# Altium project ASV4-1 Actuation Driver Board.PrjPcb (part 1 of 3)
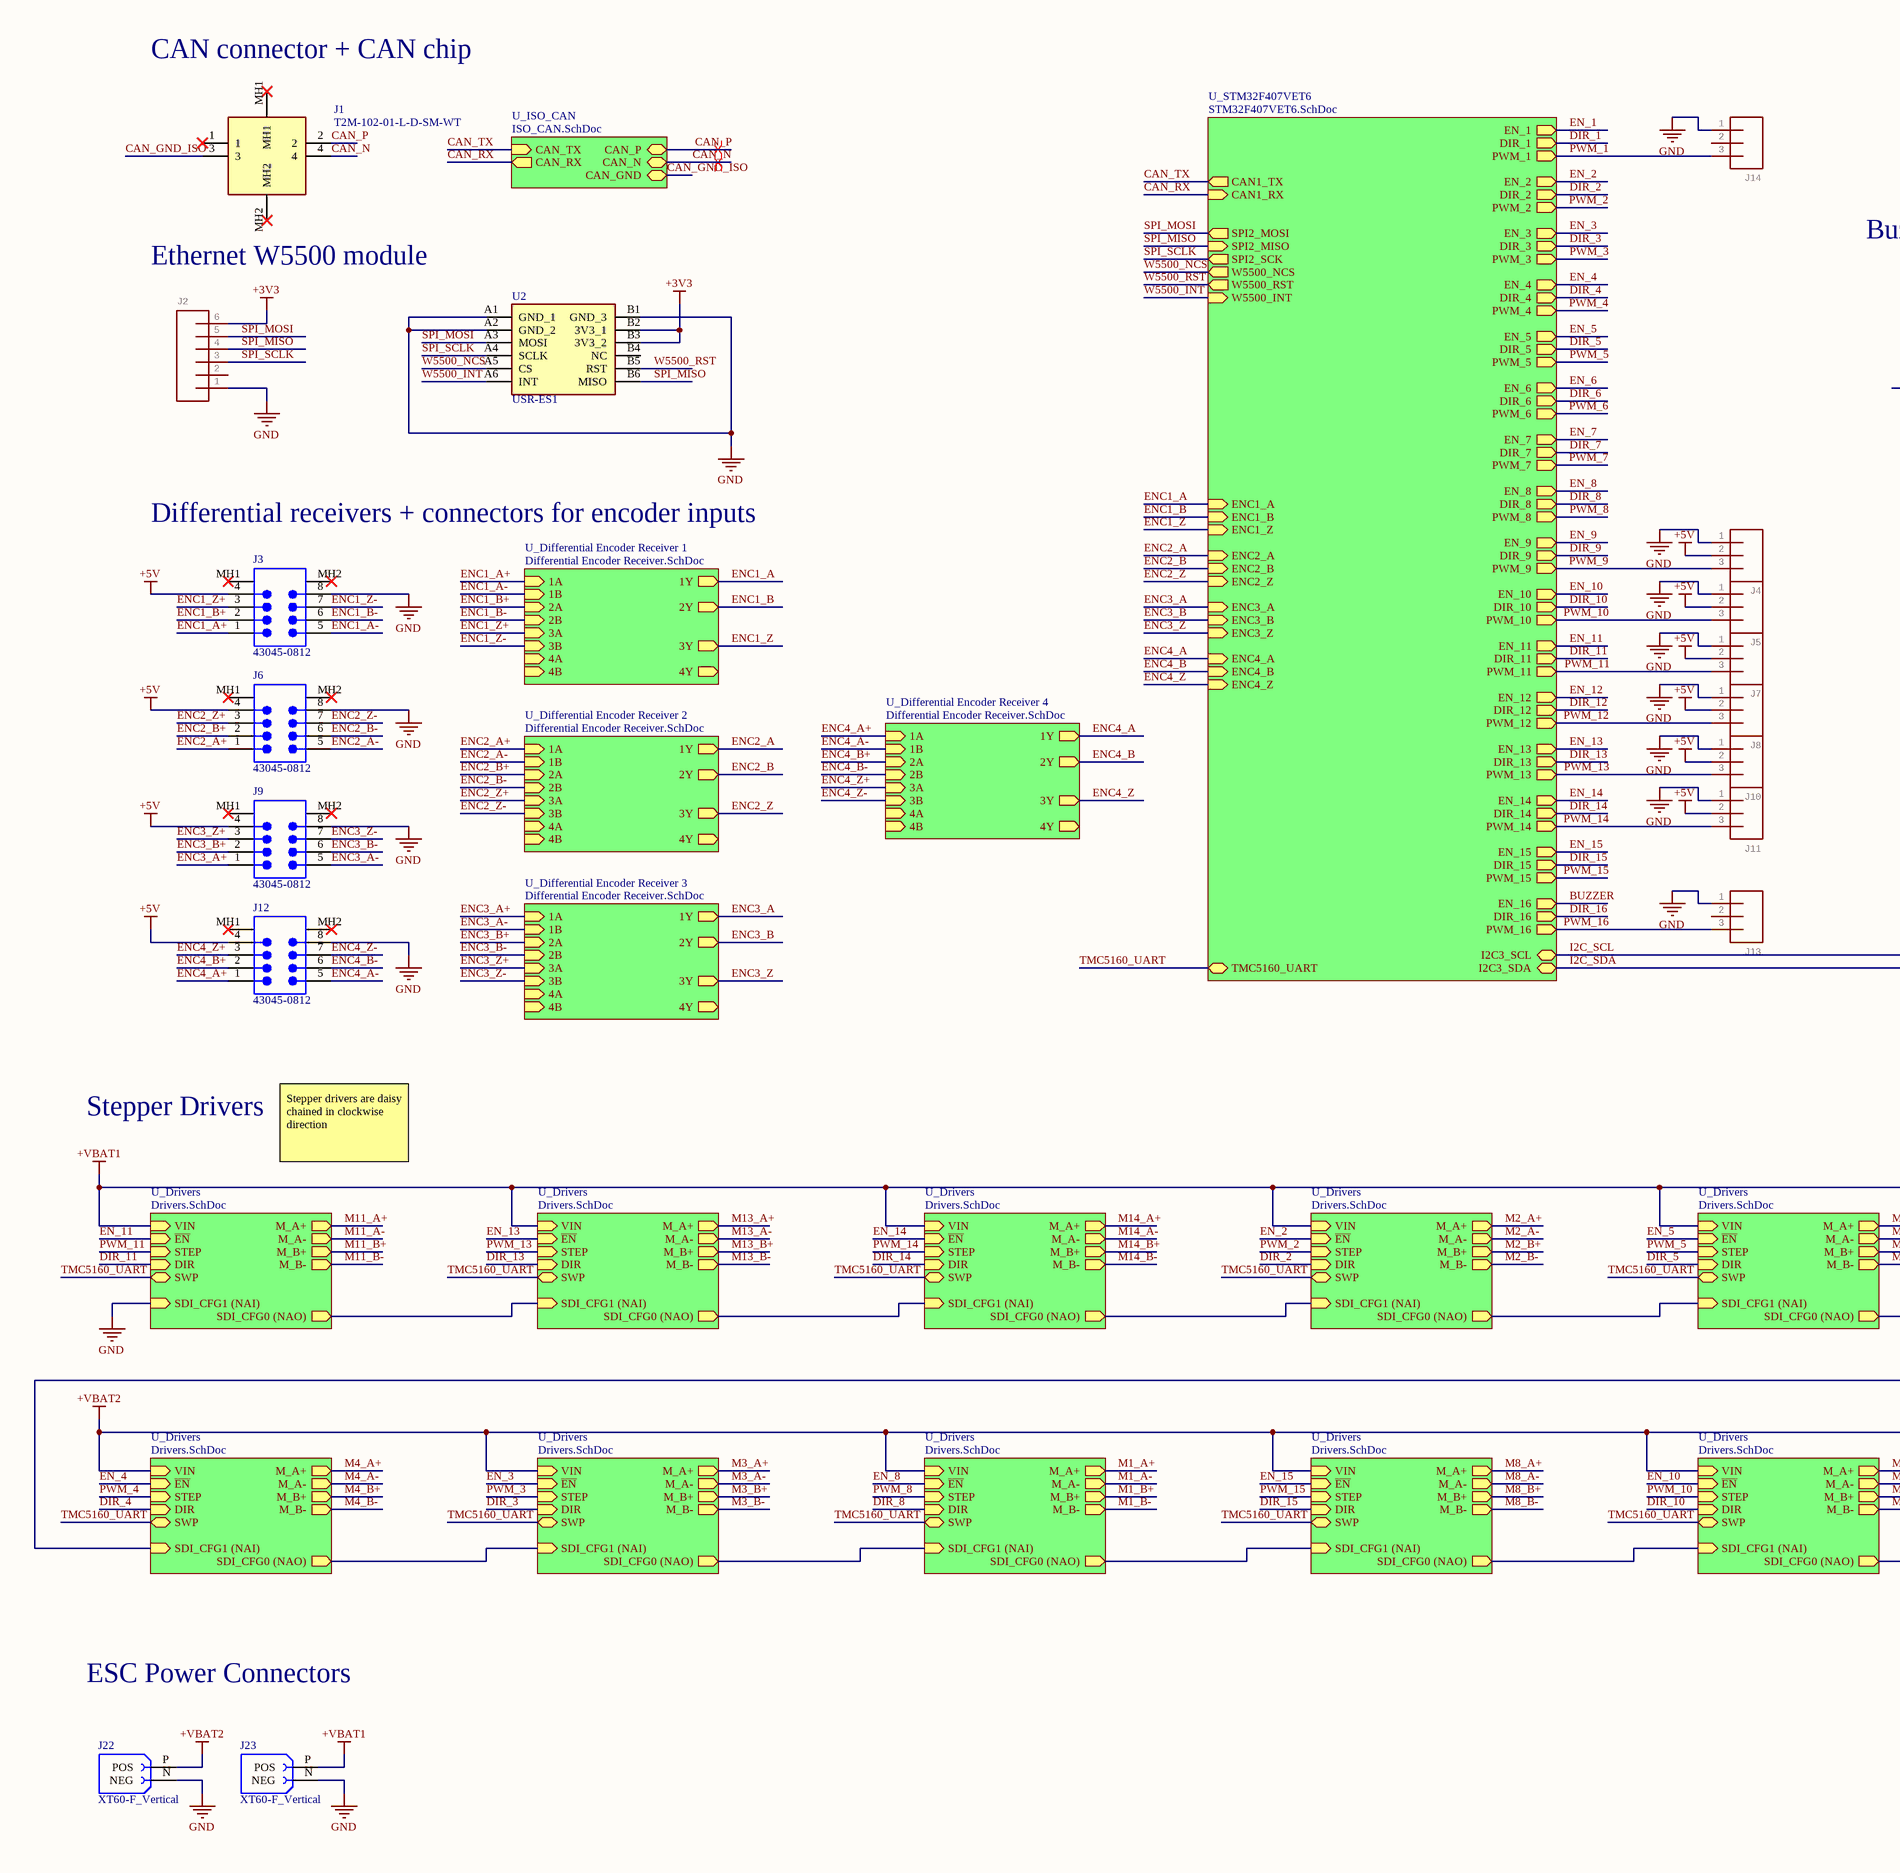
[diagram p0: Actuation.SchDoc, left]
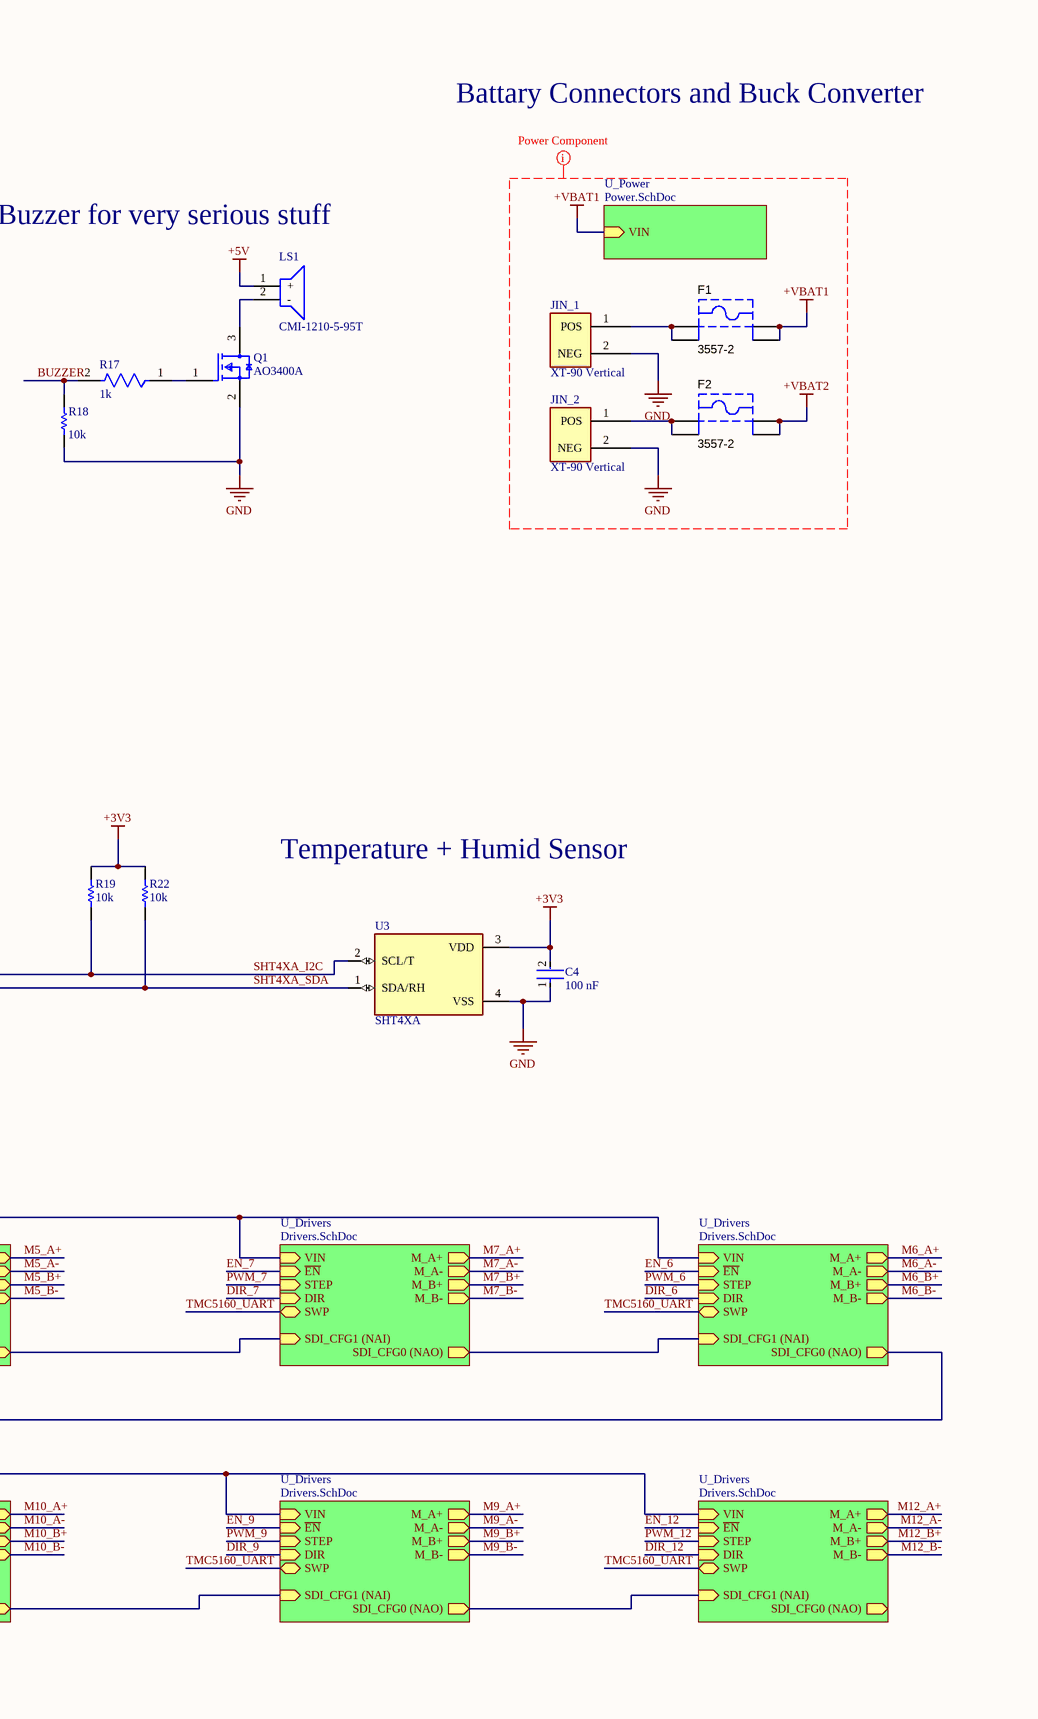
[diagram p1: Actuation.SchDoc, right]
6 sheets, 336 parts. Net scope: hierarchical (ports join the sheet entries above them; power ports are global).
Board file: Actuation Driver Board.PcbDoc
Sheets:
  Actuation.SchDoc
    U_Differential Encoder Receiver 1 = Differential Encoder Receiver.SchDoc
    U_Differential Encoder Receiver 2 = Differential Encoder Receiver.SchDoc
    U_Differential Encoder Receiver 3 = Differential Encoder Receiver.SchDoc
    U_Power = Power.SchDoc
    U_ISO_CAN = ISO_CAN.SchDoc
    U_STM32F407VET6 = STM32F407VET6.SchDoc
    U_Drivers = Drivers.SchDoc
    U_Drivers = Drivers.SchDoc
    U_Drivers = Drivers.SchDoc
    U_Drivers = Drivers.SchDoc
    U_Drivers = Drivers.SchDoc
    U_Drivers = Drivers.SchDoc
    U_Drivers = Drivers.SchDoc
    U_Drivers = Drivers.SchDoc
    U_Drivers = Drivers.SchDoc
    U_Drivers = Drivers.SchDoc
    U_Drivers = Drivers.SchDoc
    U_Drivers = Drivers.SchDoc
    U_Drivers = Drivers.SchDoc
    U_Drivers = Drivers.SchDoc
    U_Differential Encoder Receiver 4 = Differential Encoder Receiver.SchDoc

## Sheet Actuation.SchDoc
size A2; SheetNumber: 1; SheetTotal: 6

### Parts
C4  Capacitance: 100 nF  [FP-CC0603-DA-MFG]  (hidden comment: CC0603KRX7R9BB104)
F1  3557-2  [KSTN-3557-2]
F2  3557-2  [KSTN-3557-2]
J1  T2M-102-01-L-D-SM-WT  [T2M10201LDSMWT]
J2  Multi connection point. Often used as Generic Header-pin footprint for 0.1 inch spaced/style header connections    On any of the 0.1 inch spaced packages, you can populate with these:  Break Away Headers - Straight (PRT-00116)   Break Away Male Headers - Right Angle (PRT-00553)   Female Headers (PRT-00115)   Break Away Headers - Machine Pin (PRT-00117)   Break Away Female Headers - Swiss Machine Pin (PRT-00743)   Arduino Stackable Header - 6 Pin (PRT-09280)   Screw Terminals 2.54mm Pitch (6-Pin) (PRT-16499)        For SCREWTERMINALS and SPRING TERMINALS visit here:  Screw Terimnals on SparkFun.com (5mm/3.5mm/2.54mm spacing)       This device is also useful as a general connection point to wire up your design to another part of your project. Our various solder wires solder well into these plated through hole pads.  Hook-Up Wire - Assortment (Stranded, 22 AWG) (PRT-11375)   Hook-Up Wire - Assortment (Solid Core, 22 AWG) (PRT-11367)   View the entire wire category on our website here  [1X06_LOCK]  (value not drawn)
J3  43045-0812  [MOLX-43045-0812_V]
J4  Multi connection point. Often used as Generic Header-pin footprint for 0.1 inch spaced/style header connections    On any of the 0.1 inch spaced packages, you can populate with these:  Break Away Headers - Straight (PRT-00116)   Break Away Male Headers - Right Angle (PRT-00553)   Female Headers (PRT-00115)   Break Away Headers - Machine Pin (PRT-00117)   Break Away Female Headers - Swiss Machine Pin (PRT-00743)   Stackable Header - 3 Pin (Female, 0.1") (PRT-13875)        For SCREWTERMINALS and SPRING TERMINALS visit here:  Screw Terimnals on SparkFun.com (5mm/3.5mm/2.54mm spacing)       This device is also useful as a general connection point to wire up your design to another part of your project. Our various solder wires solder well into these plated through hole pads.  Hook-Up Wire - Assortment (Stranded, 22 AWG) (PRT-11375)   Hook-Up Wire - Assortment (Solid Core, 22 AWG) (PRT-11367)   View the entire wire category on our website here          Special notes:         Molex polarized connector foot print use with SKU : PRT-08232 with associated crimp pins and housings.  [1X03_LOCK]  (value not drawn)
J5  Multi connection point. Often used as Generic Header-pin footprint for 0.1 inch spaced/style header connections    On any of the 0.1 inch spaced packages, you can populate with these:  Break Away Headers - Straight (PRT-00116)   Break Away Male Headers - Right Angle (PRT-00553)   Female Headers (PRT-00115)   Break Away Headers - Machine Pin (PRT-00117)   Break Away Female Headers - Swiss Machine Pin (PRT-00743)   Stackable Header - 3 Pin (Female, 0.1") (PRT-13875)        For SCREWTERMINALS and SPRING TERMINALS visit here:  Screw Terimnals on SparkFun.com (5mm/3.5mm/2.54mm spacing)       This device is also useful as a general connection point to wire up your design to another part of your project. Our various solder wires solder well into these plated through hole pads.  Hook-Up Wire - Assortment (Stranded, 22 AWG) (PRT-11375)   Hook-Up Wire - Assortment (Solid Core, 22 AWG) (PRT-11367)   View the entire wire category on our website here          Special notes:         Molex polarized connector foot print use with SKU : PRT-08232 with associated crimp pins and housings.  [1X03_LOCK]  (value not drawn)
J6  43045-0812  [MOLX-43045-0812_V]
J7  Multi connection point. Often used as Generic Header-pin footprint for 0.1 inch spaced/style header connections    On any of the 0.1 inch spaced packages, you can populate with these:  Break Away Headers - Straight (PRT-00116)   Break Away Male Headers - Right Angle (PRT-00553)   Female Headers (PRT-00115)   Break Away Headers - Machine Pin (PRT-00117)   Break Away Female Headers - Swiss Machine Pin (PRT-00743)   Stackable Header - 3 Pin (Female, 0.1") (PRT-13875)        For SCREWTERMINALS and SPRING TERMINALS visit here:  Screw Terimnals on SparkFun.com (5mm/3.5mm/2.54mm spacing)       This device is also useful as a general connection point to wire up your design to another part of your project. Our various solder wires solder well into these plated through hole pads.  Hook-Up Wire - Assortment (Stranded, 22 AWG) (PRT-11375)   Hook-Up Wire - Assortment (Solid Core, 22 AWG) (PRT-11367)   View the entire wire category on our website here          Special notes:         Molex polarized connector foot print use with SKU : PRT-08232 with associated crimp pins and housings.  [1X03_LOCK]  (value not drawn)
J8  Multi connection point. Often used as Generic Header-pin footprint for 0.1 inch spaced/style header connections    On any of the 0.1 inch spaced packages, you can populate with these:  Break Away Headers - Straight (PRT-00116)   Break Away Male Headers - Right Angle (PRT-00553)   Female Headers (PRT-00115)   Break Away Headers - Machine Pin (PRT-00117)   Break Away Female Headers - Swiss Machine Pin (PRT-00743)   Stackable Header - 3 Pin (Female, 0.1") (PRT-13875)        For SCREWTERMINALS and SPRING TERMINALS visit here:  Screw Terimnals on SparkFun.com (5mm/3.5mm/2.54mm spacing)       This device is also useful as a general connection point to wire up your design to another part of your project. Our various solder wires solder well into these plated through hole pads.  Hook-Up Wire - Assortment (Stranded, 22 AWG) (PRT-11375)   Hook-Up Wire - Assortment (Solid Core, 22 AWG) (PRT-11367)   View the entire wire category on our website here          Special notes:         Molex polarized connector foot print use with SKU : PRT-08232 with associated crimp pins and housings.  [1X03_LOCK]  (value not drawn)
J9  43045-0812  [MOLX-43045-0812_V]
J10  Multi connection point. Often used as Generic Header-pin footprint for 0.1 inch spaced/style header connections    On any of the 0.1 inch spaced packages, you can populate with these:  Break Away Headers - Straight (PRT-00116)   Break Away Male Headers - Right Angle (PRT-00553)   Female Headers (PRT-00115)   Break Away Headers - Machine Pin (PRT-00117)   Break Away Female Headers - Swiss Machine Pin (PRT-00743)   Stackable Header - 3 Pin (Female, 0.1") (PRT-13875)        For SCREWTERMINALS and SPRING TERMINALS visit here:  Screw Terimnals on SparkFun.com (5mm/3.5mm/2.54mm spacing)       This device is also useful as a general connection point to wire up your design to another part of your project. Our various solder wires solder well into these plated through hole pads.  Hook-Up Wire - Assortment (Stranded, 22 AWG) (PRT-11375)   Hook-Up Wire - Assortment (Solid Core, 22 AWG) (PRT-11367)   View the entire wire category on our website here          Special notes:         Molex polarized connector foot print use with SKU : PRT-08232 with associated crimp pins and housings.  [1X03_LOCK]  (value not drawn)
J11  Multi connection point. Often used as Generic Header-pin footprint for 0.1 inch spaced/style header connections    On any of the 0.1 inch spaced packages, you can populate with these:  Break Away Headers - Straight (PRT-00116)   Break Away Male Headers - Right Angle (PRT-00553)   Female Headers (PRT-00115)   Break Away Headers - Machine Pin (PRT-00117)   Break Away Female Headers - Swiss Machine Pin (PRT-00743)   Stackable Header - 3 Pin (Female, 0.1") (PRT-13875)        For SCREWTERMINALS and SPRING TERMINALS visit here:  Screw Terimnals on SparkFun.com (5mm/3.5mm/2.54mm spacing)       This device is also useful as a general connection point to wire up your design to another part of your project. Our various solder wires solder well into these plated through hole pads.  Hook-Up Wire - Assortment (Stranded, 22 AWG) (PRT-11375)   Hook-Up Wire - Assortment (Solid Core, 22 AWG) (PRT-11367)   View the entire wire category on our website here          Special notes:         Molex polarized connector foot print use with SKU : PRT-08232 with associated crimp pins and housings.  [1X03_LOCK]  (value not drawn)
J12  43045-0812  [MOLX-43045-0812_V]
J13  Multi connection point. Often used as Generic Header-pin footprint for 0.1 inch spaced/style header connections    On any of the 0.1 inch spaced packages, you can populate with these:  Break Away Headers - Straight (PRT-00116)   Break Away Male Headers - Right Angle (PRT-00553)   Female Headers (PRT-00115)   Break Away Headers - Machine Pin (PRT-00117)   Break Away Female Headers - Swiss Machine Pin (PRT-00743)   Stackable Header - 3 Pin (Female, 0.1") (PRT-13875)        For SCREWTERMINALS and SPRING TERMINALS visit here:  Screw Terimnals on SparkFun.com (5mm/3.5mm/2.54mm spacing)       This device is also useful as a general connection point to wire up your design to another part of your project. Our various solder wires solder well into these plated through hole pads.  Hook-Up Wire - Assortment (Stranded, 22 AWG) (PRT-11375)   Hook-Up Wire - Assortment (Solid Core, 22 AWG) (PRT-11367)   View the entire wire category on our website here          Special notes:         Molex polarized connector foot print use with SKU : PRT-08232 with associated crimp pins and housings.  [1X03_LOCK]  (value not drawn)
J14  Multi connection point. Often used as Generic Header-pin footprint for 0.1 inch spaced/style header connections    On any of the 0.1 inch spaced packages, you can populate with these:  Break Away Headers - Straight (PRT-00116)   Break Away Male Headers - Right Angle (PRT-00553)   Female Headers (PRT-00115)   Break Away Headers - Machine Pin (PRT-00117)   Break Away Female Headers - Swiss Machine Pin (PRT-00743)   Stackable Header - 3 Pin (Female, 0.1") (PRT-13875)        For SCREWTERMINALS and SPRING TERMINALS visit here:  Screw Terimnals on SparkFun.com (5mm/3.5mm/2.54mm spacing)       This device is also useful as a general connection point to wire up your design to another part of your project. Our various solder wires solder well into these plated through hole pads.  Hook-Up Wire - Assortment (Stranded, 22 AWG) (PRT-11375)   Hook-Up Wire - Assortment (Solid Core, 22 AWG) (PRT-11367)   View the entire wire category on our website here          Special notes:         Molex polarized connector foot print use with SKU : PRT-08232 with associated crimp pins and housings.  [1X03_LOCK]  (value not drawn)
J22  XT60-F_Vertical  [AMASS_XT60-F_1x02_P7.20mm_Vertical]
J23  XT60-F_Vertical  [AMASS_XT60-F_1x02_P7.20mm_Vertical]
JIN_1  XT-90 Vertical  [XT-90 Vertical-Footprint-1]
JIN_2  XT-90 Vertical  [XT-90 Vertical-Footprint-1]
LS1  CMI-1210-5-95T  [CMI1210595T]
Q1  AO3400A  [FP-SOT23-MFG]
R17  1k  [FP-RC0603-0_55-IPC_C]
R18  Resistance: 10k  [RESC1609X50X30NL8T20]  (hidden comment: 0603WAF1002T5E)
R19  Resistance: 10k  [RESC1609X50X30NL8T20]  (hidden comment: 0603WAF1002T5E)
R22  Resistance: 10k  [RESC1609X50X30NL8T20]  (hidden comment: 0603WAF1002T5E)
U2  USR-ES1  [USRES1]
U3  SHT4XA  [SHT4XA]

### Sub-sheets
U_Differential Encoder Receiver 1 = Differential Encoder Receiver.SchDoc: 1A (in), 1B (in), 2A (in), 2B (in), 3A (in), 3B (in), 4A (in), 4B (in), 1Y (out), 2Y (out), 3Y (out), 4Y (out)
U_Differential Encoder Receiver 2 = Differential Encoder Receiver.SchDoc: 1A (in), 1B (in), 2A (in), 2B (in), 3A (in), 3B (in), 4A (in), 4B (in), 1Y (out), 2Y (out), 3Y (out), 4Y (out)
U_Differential Encoder Receiver 3 = Differential Encoder Receiver.SchDoc: 1A (in), 1B (in), 2A (in), 2B (in), 3A (in), 3B (in), 4A (in), 4B (in), 1Y (out), 2Y (out), 3Y (out), 4Y (out)
U_Differential Encoder Receiver 4 = Differential Encoder Receiver.SchDoc: 1A (in), 1B (in), 2A (in), 2B (in), 3A (in), 3B (in), 4A (in), 4B (in), 1Y (out), 2Y (out), 3Y (out), 4Y (out)
U_Drivers = Drivers.SchDoc: ~{EN} (in), STEP (in), DIR (in), SDI_CFG1 (NAI) (in), SDI_CFG0 (NAO) (out), SWP (bidir), VIN (in), M_A+ (out), M_B+ (out), M_A- (out), M_B- (out)
U_Drivers = Drivers.SchDoc: ~{EN} (in), STEP (in), DIR (in), SDI_CFG1 (NAI) (in), SDI_CFG0 (NAO) (out), SWP (bidir), VIN (in), M_A+ (out), M_A- (out), M_B+ (out), M_B- (out)
U_Drivers = Drivers.SchDoc: ~{EN} (in), STEP (in), DIR (in), SDI_CFG1 (NAI) (in), SDI_CFG0 (NAO) (out), SWP (bidir), VIN (in), M_A+ (out), M_A- (out), M_B+ (out), M_B- (out)
U_Drivers = Drivers.SchDoc: ~{EN} (in), STEP (in), DIR (in), SDI_CFG1 (NAI) (in), SDI_CFG0 (NAO) (out), SWP (bidir), VIN (in), M_A+ (out), M_A- (out), M_B+ (out), M_B- (out)
U_Drivers = Drivers.SchDoc: ~{EN} (in), STEP (in), DIR (in), SDI_CFG1 (NAI) (in), SDI_CFG0 (NAO) (out), SWP (bidir), VIN (in), M_A+ (out), M_A- (out), M_B+ (out), M_B- (out)
U_Drivers = Drivers.SchDoc: ~{EN} (in), STEP (in), DIR (in), SDI_CFG1 (NAI) (in), SDI_CFG0 (NAO) (out), SWP (bidir), VIN (in), M_A+ (out), M_A- (out), M_B+ (out), M_B- (out)
U_Drivers = Drivers.SchDoc: ~{EN} (in), STEP (in), DIR (in), SDI_CFG1 (NAI) (in), SDI_CFG0 (NAO) (out), SWP (bidir), VIN (in), M_A+ (out), M_A- (out), M_B+ (out), M_B- (out)
U_Drivers = Drivers.SchDoc: ~{EN} (in), STEP (in), DIR (in), SDI_CFG1 (NAI) (in), SDI_CFG0 (NAO) (out), SWP (bidir), VIN (in), M_B- (out), M_B+ (out), M_A- (out), M_A+ (out)
U_Drivers = Drivers.SchDoc: ~{EN} (in), STEP (in), DIR (in), SDI_CFG1 (NAI) (in), SDI_CFG0 (NAO) (out), SWP (bidir), VIN (in), M_A+ (out), M_A- (out), M_B+ (out), M_B- (out)
U_Drivers = Drivers.SchDoc: ~{EN} (in), STEP (in), DIR (in), SDI_CFG1 (NAI) (in), SDI_CFG0 (NAO) (out), SWP (bidir), VIN (in), M_A+ (out), M_A- (out), M_B+ (out), M_B- (out)
U_Drivers = Drivers.SchDoc: ~{EN} (in), STEP (in), DIR (in), SDI_CFG1 (NAI) (in), SDI_CFG0 (NAO) (out), SWP (bidir), VIN (in), M_A+ (out), M_A- (out), M_B+ (out), M_B- (out)
U_Drivers = Drivers.SchDoc: ~{EN} (in), STEP (in), DIR (in), SDI_CFG1 (NAI) (in), SDI_CFG0 (NAO) (out), SWP (bidir), VIN (in), M_A+ (out), M_A- (out), M_B+ (out), M_B- (out)
U_Drivers = Drivers.SchDoc: ~{EN} (in), STEP (in), DIR (in), SDI_CFG1 (NAI) (in), SDI_CFG0 (NAO) (out), SWP (bidir), VIN (in), M_A+ (out), M_A- (out), M_B+ (out), M_B- (out)
U_Drivers = Drivers.SchDoc: ~{EN} (in), STEP (in), DIR (in), SDI_CFG1 (NAI) (in), SDI_CFG0 (NAO) (out), SWP (bidir), VIN (in), M_A+ (out), M_A- (out), M_B+ (out), M_B- (out)
U_ISO_CAN = ISO_CAN.SchDoc: CAN_P (bidir), CAN_N (bidir), CAN_GND (bidir), CAN_TX (in), CAN_RX (out)
U_Power = Power.SchDoc: VIN (in)
U_STM32F407VET6 = STM32F407VET6.SchDoc: EN_16 (out), DIR_16 (out), EN_1 (out), ENC3_A (in), ENC3_B (in), ENC4_A (in), ENC4_B (in), PWM_14 (out), PWM_13 (out), PWM_4 (out), PWM_3 (out), W5500_NCS (out), SPI2_SCK (out), SPI2_MISO (in), SPI2_MOSI (out), CAN1_RX (in), CAN1_TX (out), ENC3_Z (in), ENC4_Z (in), EN_14 (out), DIR_14 (out), W5500_INT (in), W5500_RST (out), DIR_10 (out), EN_10 (out), DIR_9 (out), EN_9 (out), PWM_9 (out), PWM_10 (out), DIR_4 (out), PWM_2 (out), ENC2_A (in), ENC2_B (in), PWM_5 (out), PWM_6 (out), EN_6 (out), DIR_6 (out), PWM_16 (out), PWM_15 (out), ENC1_A (in), ENC1_B (in), ENC1_Z (in), DIR_7 (out), EN_7 (out), EN_5 (out), DIR_5 (out), ENC2_Z (in), EN_15 (out), DIR_15 (out), DIR_8 (out), EN_8 (out), PWM_8 (out), PWM_7 (out), EN_12 (out), DIR_12 (out), DIR_13 (out), EN_13 (out), EN_11 (out), DIR_11 (out), PWM_11 (out), PWM_12 (out), DIR_1 (out), EN_2 (out), DIR_2 (out), EN_3 (out), DIR_3 (out), EN_4 (out), PWM_1 (out), I2C3_SDA (bidir), TMC5160_UART (bidir), I2C3_SCL (bidir)

### Nets
+3V3: C4.2 J2.6 R19.2 R22.2 U2.B2(3V3_1) U2.B3(3V3_2) U3.3(VDD)
+5V: J3.4 J4.2 J5.2 J6.4 J7.2 J8.2 J9.4 J10.2 J11.2 J12.4 LS1.1(+)
+VBAT1: F1.3 F1.4 J23.P(POS) ; sheet U_Power/VIN, sheet U_Drivers/VIN, sheet U_Drivers/VIN, sheet U_Drivers/VIN, sheet U_Drivers/VIN, sheet U_Drivers/VIN, sheet U_Drivers/VIN, sheet U_Drivers/VIN  [project net STEPPER_VIN]
+VBAT2: F2.3 F2.4 J22.P(POS) ; sheet U_Drivers/VIN, sheet U_Drivers/VIN, sheet U_Drivers/VIN, sheet U_Drivers/VIN, sheet U_Drivers/VIN, sheet U_Drivers/VIN, sheet U_Drivers/VIN  [project net STEPPER_VIN]
GND: C4.1 J2.1 J3.8 J4.1 J5.1 J6.8 J7.1 J8.1 J9.8 J10.1 J11.1 J12.8 J13.1 J14.1 J22.N(NEG) J23.N(NEG) JIN_1.2(NEG) JIN_2.2(NEG) Q1.2(S) R18.2 U2.A1(GND_1) U2.A2(GND_2) U2.B1(GND_3) U3.4(VSS) ; sheet U_Drivers/SDI_CFG1 (NAI)
BUZZER: R17.2 R18.1 ; sheet U_STM32F407VET6/EN_16
CAN_GND_ISO: J1.3 ; sheet U_ISO_CAN/CAN_GND
CAN_N: J1.4 ; sheet U_ISO_CAN/CAN_N
CAN_P: J1.2 ; sheet U_ISO_CAN/CAN_P
CAN_RX: sheet U_ISO_CAN/CAN_RX, sheet U_STM32F407VET6/CAN1_RX  [project net CAN1_RX]
CAN_TX: sheet U_ISO_CAN/CAN_TX, sheet U_STM32F407VET6/CAN1_TX  [project net CAN1_TX]
DIR_2: sheet U_STM32F407VET6/DIR_2, sheet U_Drivers/DIR
DIR_3: sheet U_STM32F407VET6/DIR_3, sheet U_Drivers/DIR
DIR_4: sheet U_STM32F407VET6/DIR_4, sheet U_Drivers/DIR
DIR_5: sheet U_STM32F407VET6/DIR_5, sheet U_Drivers/DIR
DIR_6: sheet U_STM32F407VET6/DIR_6, sheet U_Drivers/DIR
DIR_7: sheet U_STM32F407VET6/DIR_7, sheet U_Drivers/DIR
DIR_8: sheet U_STM32F407VET6/DIR_8, sheet U_Drivers/DIR
DIR_9: sheet U_STM32F407VET6/DIR_9, sheet U_Drivers/DIR
DIR_10: sheet U_STM32F407VET6/DIR_10, sheet U_Drivers/DIR
DIR_11: sheet U_STM32F407VET6/DIR_11, sheet U_Drivers/DIR
DIR_12: sheet U_STM32F407VET6/DIR_12, sheet U_Drivers/DIR
DIR_13: sheet U_STM32F407VET6/DIR_13, sheet U_Drivers/DIR
DIR_14: sheet U_STM32F407VET6/DIR_14, sheet U_Drivers/DIR
DIR_15: sheet U_STM32F407VET6/DIR_15, sheet U_Drivers/DIR
EN_2: sheet U_STM32F407VET6/EN_2, sheet U_Drivers/~{EN}
EN_3: sheet U_STM32F407VET6/EN_3, sheet U_Drivers/~{EN}
EN_4: sheet U_STM32F407VET6/EN_4, sheet U_Drivers/~{EN}
EN_5: sheet U_STM32F407VET6/EN_5, sheet U_Drivers/~{EN}
EN_6: sheet U_STM32F407VET6/EN_6, sheet U_Drivers/~{EN}
EN_7: sheet U_STM32F407VET6/EN_7, sheet U_Drivers/~{EN}
EN_8: sheet U_STM32F407VET6/EN_8, sheet U_Drivers/~{EN}
EN_9: sheet U_STM32F407VET6/EN_9, sheet U_Drivers/~{EN}
EN_10: sheet U_STM32F407VET6/EN_10, sheet U_Drivers/~{EN}
EN_11: sheet U_STM32F407VET6/EN_11, sheet U_Drivers/~{EN}
EN_12: sheet U_STM32F407VET6/EN_12, sheet U_Drivers/~{EN}
EN_13: sheet U_STM32F407VET6/EN_13, sheet U_Drivers/~{EN}
EN_14: sheet U_STM32F407VET6/EN_14, sheet U_Drivers/~{EN}
EN_15: sheet U_STM32F407VET6/EN_15, sheet U_Drivers/~{EN}
ENC1_A: sheet U_Differential Encoder Receiver 1/1Y, sheet U_STM32F407VET6/ENC1_A
ENC1_A+: J3.1 ; sheet U_Differential Encoder Receiver 1/1A  [project net 1_P]
ENC1_A-: J3.5 ; sheet U_Differential Encoder Receiver 1/1B  [project net 1_N]
ENC1_B: sheet U_Differential Encoder Receiver 1/2Y, sheet U_STM32F407VET6/ENC1_B
ENC1_B+: J3.2 ; sheet U_Differential Encoder Receiver 1/2A  [project net 2_P]
ENC1_B-: J3.6 ; sheet U_Differential Encoder Receiver 1/2B  [project net 2_N]
ENC1_Z: sheet U_Differential Encoder Receiver 1/3Y, sheet U_STM32F407VET6/ENC1_Z
ENC1_Z+: J3.3 ; sheet U_Differential Encoder Receiver 1/3A  [project net 3_P]
ENC1_Z-: J3.7 ; sheet U_Differential Encoder Receiver 1/3B  [project net 3_N]
ENC2_A: sheet U_Differential Encoder Receiver 2/1Y, sheet U_STM32F407VET6/ENC2_A
ENC2_A+: J6.1 ; sheet U_Differential Encoder Receiver 2/1A  [project net 1_P]
ENC2_A-: J6.5 ; sheet U_Differential Encoder Receiver 2/1B  [project net 1_N]
ENC2_B: sheet U_Differential Encoder Receiver 2/2Y, sheet U_STM32F407VET6/ENC2_B
ENC2_B+: J6.2 ; sheet U_Differential Encoder Receiver 2/2A  [project net 2_P]
ENC2_B-: J6.6 ; sheet U_Differential Encoder Receiver 2/2B  [project net 2_N]
ENC2_Z: sheet U_Differential Encoder Receiver 2/3Y, sheet U_STM32F407VET6/ENC2_Z
ENC2_Z+: J6.3 ; sheet U_Differential Encoder Receiver 2/3A  [project net 3_P]
ENC2_Z-: J6.7 ; sheet U_Differential Encoder Receiver 2/3B  [project net 3_N]
ENC3_A: sheet U_Differential Encoder Receiver 3/1Y, sheet U_STM32F407VET6/ENC3_A
ENC3_A+: J9.1 ; sheet U_Differential Encoder Receiver 3/1A  [project net 1_P]
ENC3_A-: J9.5 ; sheet U_Differential Encoder Receiver 3/1B  [project net 1_N]
ENC3_B: sheet U_Differential Encoder Receiver 3/2Y, sheet U_STM32F407VET6/ENC3_B
ENC3_B+: J9.2 ; sheet U_Differential Encoder Receiver 3/2A  [project net 2_P]
ENC3_B-: J9.6 ; sheet U_Differential Encoder Receiver 3/2B  [project net 2_N]
ENC3_Z: sheet U_Differential Encoder Receiver 3/3Y, sheet U_STM32F407VET6/ENC3_Z
ENC3_Z+: J9.3 ; sheet U_Differential Encoder Receiver 3/3A  [project net 3_P]
ENC3_Z-: J9.7 ; sheet U_Differential Encoder Receiver 3/3B  [project net 3_N]
ENC4_A: sheet U_STM32F407VET6/ENC4_A, sheet U_Differential Encoder Receiver 4/1Y
ENC4_A+: J12.1 ; sheet U_Differential Encoder Receiver 4/1A  [project net 1_P]
ENC4_A-: J12.5 ; sheet U_Differential Encoder Receiver 4/1B  [project net 1_N]
ENC4_B: sheet U_STM32F407VET6/ENC4_B, sheet U_Differential Encoder Receiver 4/2Y
ENC4_B+: J12.2 ; sheet U_Differential Encoder Receiver 4/2A  [project net 2_P]
ENC4_B-: J12.6 ; sheet U_Differential Encoder Receiver 4/2B  [project net 2_N]
ENC4_Z: sheet U_STM32F407VET6/ENC4_Z, sheet U_Differential Encoder Receiver 4/3Y
ENC4_Z+: J12.3 ; sheet U_Differential Encoder Receiver 4/3A  [project net 3_P]
ENC4_Z-: J12.7 ; sheet U_Differential Encoder Receiver 4/3B  [project net 3_N]
I2C_SCL: R19.1 U3.2(SCL/T) ; sheet U_STM32F407VET6/I2C3_SCL  [also labelled SHT4XA_I2C]  [project net I2C3_SCL]
I2C_SDA: R22.1 U3.1(SDA/RH) ; sheet U_STM32F407VET6/I2C3_SDA  [also labelled SHT4XA_SDA]  [project net I2C3_SDA]
PWM_1: J14.3 ; sheet U_STM32F407VET6/PWM_1
PWM_2: sheet U_STM32F407VET6/PWM_2, sheet U_Drivers/STEP
PWM_3: sheet U_STM32F407VET6/PWM_3, sheet U_Drivers/STEP
PWM_4: sheet U_STM32F407VET6/PWM_4, sheet U_Drivers/STEP
PWM_5: sheet U_STM32F407VET6/PWM_5, sheet U_Drivers/STEP
PWM_6: sheet U_STM32F407VET6/PWM_6, sheet U_Drivers/STEP
PWM_7: sheet U_STM32F407VET6/PWM_7, sheet U_Drivers/STEP
PWM_8: sheet U_STM32F407VET6/PWM_8, sheet U_Drivers/STEP
PWM_9: J4.3 ; sheet U_STM32F407VET6/PWM_9, sheet U_Drivers/STEP
PWM_10: J5.3 ; sheet U_STM32F407VET6/PWM_10, sheet U_Drivers/STEP
PWM_11: J7.3 ; sheet U_STM32F407VET6/PWM_11, sheet U_Drivers/STEP
PWM_12: J8.3 ; sheet U_STM32F407VET6/PWM_12, sheet U_Drivers/STEP
PWM_13: J10.3 ; sheet U_STM32F407VET6/PWM_13, sheet U_Drivers/STEP
PWM_14: J11.3 ; sheet U_STM32F407VET6/PWM_14, sheet U_Drivers/STEP
PWM_15: sheet U_STM32F407VET6/PWM_15, sheet U_Drivers/STEP
PWM_16: J13.3 ; sheet U_STM32F407VET6/PWM_16
SPI_MISO: J2.4 U2.B6(MISO) ; sheet U_STM32F407VET6/SPI2_MISO  [project net SPI2_MISO]
SPI_MOSI: J2.5 U2.A3(MOSI) ; sheet U_STM32F407VET6/SPI2_MOSI  [project net SPI2_MOSI]
SPI_SCLK: J2.3 U2.A4(SCLK) ; sheet U_STM32F407VET6/SPI2_SCK  [project net SPI2_SCK]
TMC5160_UART: sheet U_STM32F407VET6/TMC5160_UART, sheet U_Drivers/SWP, sheet U_Drivers/SWP, sheet U_Drivers/SWP, sheet U_Drivers/SWP, sheet U_Drivers/SWP, sheet U_Drivers/SWP, sheet U_Drivers/SWP, sheet U_Drivers/SWP, sheet U_Drivers/SWP, sheet U_Drivers/SWP, sheet U_Drivers/SWP, sheet U_Drivers/SWP, sheet U_Drivers/SWP, sheet U_Drivers/SWP
W5500_INT: U2.A6(INT) ; sheet U_STM32F407VET6/W5500_INT
W5500_NCS: U2.A5(CS) ; sheet U_STM32F407VET6/W5500_NCS
W5500_RST: U2.B5(RST) ; sheet U_STM32F407VET6/W5500_RST
NetF1_1: F1.1 F1.2 JIN_1.1(POS)
NetF2_1: F2.1 F2.2 JIN_2.1(POS)
NetLS1_2: LS1.2(-) Q1.3(D)
NetQ1_1: Q1.1(G) R17.1
NetU4_U_Drivers#1_12: sheet U_Drivers/SDI_CFG0 (NAO), sheet U_Drivers/SDI_CFG1 (NAI)
NetU4_U_Drivers#1_15: sheet U_Drivers/SDI_CFG1 (NAI), sheet U_Drivers/SDI_CFG0 (NAO)
NetU4_U_Drivers#2_12: sheet U_Drivers/SDI_CFG0 (NAO), sheet U_Drivers/SDI_CFG1 (NAI)
NetU4_U_Drivers#2_15: sheet U_Drivers/SDI_CFG1 (NAI), sheet U_Drivers/SDI_CFG0 (NAO)
NetU4_U_Drivers#3_12: sheet U_Drivers/SDI_CFG0 (NAO), sheet U_Drivers/SDI_CFG1 (NAI)
NetU4_U_Drivers#4_12: sheet U_Drivers/SDI_CFG0 (NAO), sheet U_Drivers/SDI_CFG1 (NAI)
NetU4_U_Drivers#4_15: sheet U_Drivers/SDI_CFG1 (NAI), sheet U_Drivers/SDI_CFG0 (NAO)
NetU4_U_Drivers#6_15: sheet U_Drivers/SDI_CFG1 (NAI), sheet U_Drivers/SDI_CFG0 (NAO)
NetU4_U_Drivers#8_15: sheet U_Drivers/SDI_CFG1 (NAI), sheet U_Drivers/SDI_CFG0 (NAO)
NetU4_U_Drivers#9_12: sheet U_Drivers/SDI_CFG0 (NAO), sheet U_Drivers/SDI_CFG1 (NAI)
NetU4_U_Drivers#9_15: sheet U_Drivers/SDI_CFG1 (NAI), sheet U_Drivers/SDI_CFG0 (NAO)
NetU4_U_Drivers#11_12: sheet U_Drivers/SDI_CFG0 (NAO), sheet U_Drivers/SDI_CFG1 (NAI)
NetU4_U_Drivers#12_15: sheet U_Drivers/SDI_CFG1 (NAI), sheet U_Drivers/SDI_CFG0 (NAO)

Not connected (* = marked no-connect by the designer): J1 1* MH1* MH2*; J2 2; J3 MH1* MH2*; J6 MH1* MH2*; J9 MH1* MH2*; J12 MH1* MH2*; J13 2; J14 2; U2 B4(NC)

### Layout directives
differential pair: CAN_N, CAN_P
CompClassName: Power Component: +VBAT1, +VBAT2, GND

### Notes on the sheet
- CAN connector + CAN chip
- Battary Connectors and Buck Converter
- Ethernet W5500 module
- Buzzer for very serious stuff
- Differential receivers + connectors for encoder inputs
- Temperature + Humid Sensor
- Stepper Drivers
- Stepper drivers are daisy chained in clockwise direction
- ESC Power Connectors

### Library data of the parts
C4 = CMP-2100-03601-2: CAP CER 0.1UF 50V X7R 0603; Manufacturer: YAGEO; Material: Ceramic; Temperature Coefficient: 15%; Tolerance: 0.1; Value: 100 nF; Height: 0.9mm; Voltage: 50 V; ComponentLink2Description: Datasheet; Device Class L2: Capacitors; Temperature Range High: +125°C; Category: Cap; Footprint Url: http://www.yageo.com/exep/pages/download/literatures/UPY-C_GEN_24.pdf; ComponentLink2URL: http://www.yageo.com/documents/recent/UPY-GPHC_X7R_6.3V-to-50V_18.pdf; Package: CC0603-DA; Temperature: -55°C to +125°C; Voltage Rating: 50 V; Temperature Characteristic: X7R; Device Class L1: Passive Components; Temperature Range Low: -55°C; Manufacturer Part Number: CC0603KRX7R9BB104; RoHS: TRUE; Automotive: No; Device Class L3: Ceramic Capacitors; Octopart: https://octopart.com/cc0603krx7r9bb104-yageo-42244635; Mouser Description: Multilayer Ceramic Capacitor, CC Series, 0.1 - F, - 10%, X7R, 50 V, 0603 [1608 Metric]; Lead Free: Yes; Digikey Description: CAP CER 0.1UF 50V X7R 0603
F1 F2 = CMP-2000-05461-1: FUSE HOLDER, PCB MOUNT, 500VAC, 20A, ROHS; Manufacturer: Keystone-Electronics; Number of Circuits: 1; Voltage: 500V; Fuseholder Type: Block; Fuse Type: Blade; Fuse Size: 0.43"Lx0.15"Wx0.64"H(10.92mmx3.81mmx16.25mm); For Use With/Related Products: ATC,ATO257,MINI897; Current Rating: 30A; Datasheet URL: http://datasheet.octopart.com/3557-2-Keystone-datasheet-15715937.pdf; Orientation: Vertical; Family: Fuseholders; Datasheet Version: Apr-13; Contact Finish: TinNickel; Mounting Type: PCB; Series: -; Category: CircuitProtection; Termination Style: PCPin; Contact Material: Brass; Manufacturer URL: http://www.keyelco.com/
J1 = CMP-062-000000-1: Connector; Manufacturer_Name: SAMTEC; Manufacturer_Part_Number: T2M-102-01-L-D-SM-WT; Mouser Price/Stock: https://www.mouser.co.uk/ProductDetail/Samtec/T2M-102-01-L-D-SM-WT?qs=PB6%2FjmICvI1RhUpc5sXmcA%3D%3D; Datasheet Link: https://suddendocs.samtec.com/prints/t2m-1xx-xx-x-d-xx-xx-x-xx-mkt.pdf?_gl=1*1h8jfhh*_ga*ODgwNjE2ODg0LjE2NDkxNjE4OTQ.*_ga_3KFNZC07WW*MTY4MDE1NTk5OS4xMjYuMC4xNjgwMTU2MDg2LjYwLjAuMA..; Height: 6.68mm; Source: SamacSys.SchLib; Design Item ID: T2M-102-01-L-D-SM-WT; Mouser Part Number: 200-T2M10201LDSMWT
J2 = CONN_06LOCK: GateName_1: J1; DeviceName: LOCK; SymbolName_1: CONN_06; LibraryName: SparkFun-Connectors; DeviceSetName: CONN_06; Package: 1X06_LOCK
J3 J6 J9 J12 = CMP-1594-00003-1: 3 mm Pitch Micro-Fit 3.0 Connector, 17.27 mm Mated Height, Vertical, Through Hole, 8 Circuits, -40 to 105 degC, RoHS, Tray; Pitch: 3 mm; No. of Positions: 8; No. of Rows: 2; ComponentLink2Description: Datasheet; ComponentLink2URL: http://www.molex.com/webdocs/datasheets/pdf/en-us/0430450812_PCB_HEADERS.pdf; Orientation: Vertical; PartNumber: 43045-0812; Packing: Tray; Temperature Min: -40 degC; RoHS: TRUE; ComponentLink3Description: Package Specification; Temperature Max: 105 degC; ComponentLink3URL: http://www.molex.com/pdm_docs/sd/430450812_sd.pdf; Mounting Technology: Through Hole; PackageVersion: Rev. F, 06/2009; ComponentLink1Description: Manufacturer URL; PackageDescription: 8-Pin PCB Header, Vertical, Pitch 3 mm, Mated Height 17.27 mm, Through Hole; ComponentLink1URL: http://www.molex.com/
J4 J5 J7 J8 J10 J11 J13 J14 = CONN_03LOCK: GateName_1: J1; DeviceName: LOCK; SymbolName_1: CONN_03; LibraryName: SparkFun-Connectors; DeviceSetName: CONN_03; Package: 1X03_LOCK
J22 J23 = CMP-141-000024-1
JIN_1 JIN_2 = CMP-141-000008-1: ComponentLink1Description: Mech Drawing; ComponentLink1URL: https://components101.com/connectors/xt90-battery-connector
LS1 = CMI-1210-5-95T: Loudspeaker or Buzzer; Manufacturer_Name: CUI Devices; Datasheet Link: https://www.cuidevices.com/product/resource/cmi-1210-5-95t.pdf; Height: 10mm; Manufacturer_Part_Number: CMI-1210-5-95T; Mouser Part Number: 179-CMI-1210-5-95T; Mouser Price/Stock: https://www.mouser.co.uk/ProductDetail/CUI-Devices/CMI-1210-5-95T?qs=Rp5uXu7WBW9WJf9tZv97Vg%3D%3D
Q1 = CMP-83955-000006-1: MOSFET N-CH 30V 5.7A SOT23; Input Capacitance: 630pF; Number of Elements: 1; Rds On Max: 26.5mR; Max Power Dissipation: 1.4W; Gate to Source Voltage (Vgs): 12V; Min Operating Temperature: -55°C; Lead Free: Lead Free; Number of Pins: 3; Drain to Source Voltage (Vdss): 30V; Case/Package: SOT-23; Mount: Surface Mount; Continuous Drain Current (ID): 5.7A; Radiation Hardening: No; Packaging: Tape and Reel; Max Operating Temperature: 150°C; Power Dissipation: 1.4W
R17 = CMP-1659-00009-5: RC0603FR-071KL. RES 1K OHM 1% 1/10W 0603; Resistance: 1kR; Voltage Rating: 50V; Power Rating: 100mW; Temperature Coefficient: 100ppm/°C; Military Standard: Not; REACH SVHC: No SVHC; Size Code: 0603; Features: Moisture Resistant; Number of Terminations: 2; Technology: THICK FILM; Series: RC; Case Code (Metric): 1608; Resistance Tolerance: 1%; Resistor Type: Thick Film; Termination: SMD/SMT; Contact Plating: Tin; Radiation Hardening: No; Min Operating Temperature: -55°C; Max Operating Temperature: 155°C; Packaging: Tape and Reel; Max Power Dissipation: 100mW; RoHS Compliant: Yes; Height: 0.45mm; Lead Free: Lead Free; Case/Package: 0603; Length: 1.6mm; Tolerance: 1%; Case Code (Imperial): 0603; Construction: Rectangular; Depth: 0.8mm
R18 R19 R22 = CMP-1666-00005-4: 100mW Thick Film Resistors 75V ±100ppm/℃ ±1% 10kΩ 0603 Chip Resistor - Surface Mount ROHS; Max Operating Temperature: 155 degC; Voltage Rating: 75 V; PackageDescription: 2-Pin Surface Mount Device, Body 1.575 x 0.85 mm; ComponentLink1Description: Manufacturer URL; RoHSCompliant: true; PackageReference: 0603; REACH SVHC: Unknown; Length: 1.55 mm; Packaging: Tape and Reel; Min Operating Temperature: -55 degC; Mounting Technology: Surface Mount; ComponentLink2URL: https://datasheet.ciiva.com/11809/0900766b80d98afc-11809037.pdf; Height: 0.45 mm; ComponentLink2Description: Datasheet; Package Quantity: 5000; ComponentLink1URL: http://www.vishay.com/
U2 = CMP-065-000000-2: Integrated Circuit; Manufacturer_Name: Smart Electronics; Source: SamacSys.SchLib; Manufacturer_Part_Number: USR-ES1; Design Item ID: USR-ES1; Datasheet Link: https://www.aliexpress.com/item/Free-Shipping-USR-ES1-W5500-Chip-New-SPI-to-LAN-Ethernet-Converter-TCP-IP-Mod/32714438223.html?spm=a2g0s.9042311.0.0.27424c4dBBEz2G; Height: 3mm
U3 = CMP-163-000000-1: Automotive Grade Relative Humidity Temperature Sensor, Â±3 %RH, Â±0.3 Â°C; MF: Sensirion; MP: SHT40A-AD1B-R3; Component Type: Standard; Pin Count: 4; SnapEDA_Link: https://www.snapeda.com/parts/SHT40A-AD1B-R3/Sensirion/view-part/?ref=snap; Price: None; Package: DFN-4 Sensirion; Availability: Not in stock; Check_prices: https://www.snapeda.com/parts/SHT40A-AD1B-R3/Sensirion/view-part/?ref=eda; Design Item ID: SHT4XA; Source: SHT4XA.SchLib; Value: *

## Sheet Differential Encoder Receiver.SchDoc
size A4; SheetNumber: 5; SheetTotal: 6
Used 4 times, as channels U_Differential Encoder Receiver 1, U_Differential Encoder Receiver 2, U_Differential Encoder Receiver 3, U_Differential Encoder Receiver 4. Parts and nets are listed once, with the designators drawn on the sheet.
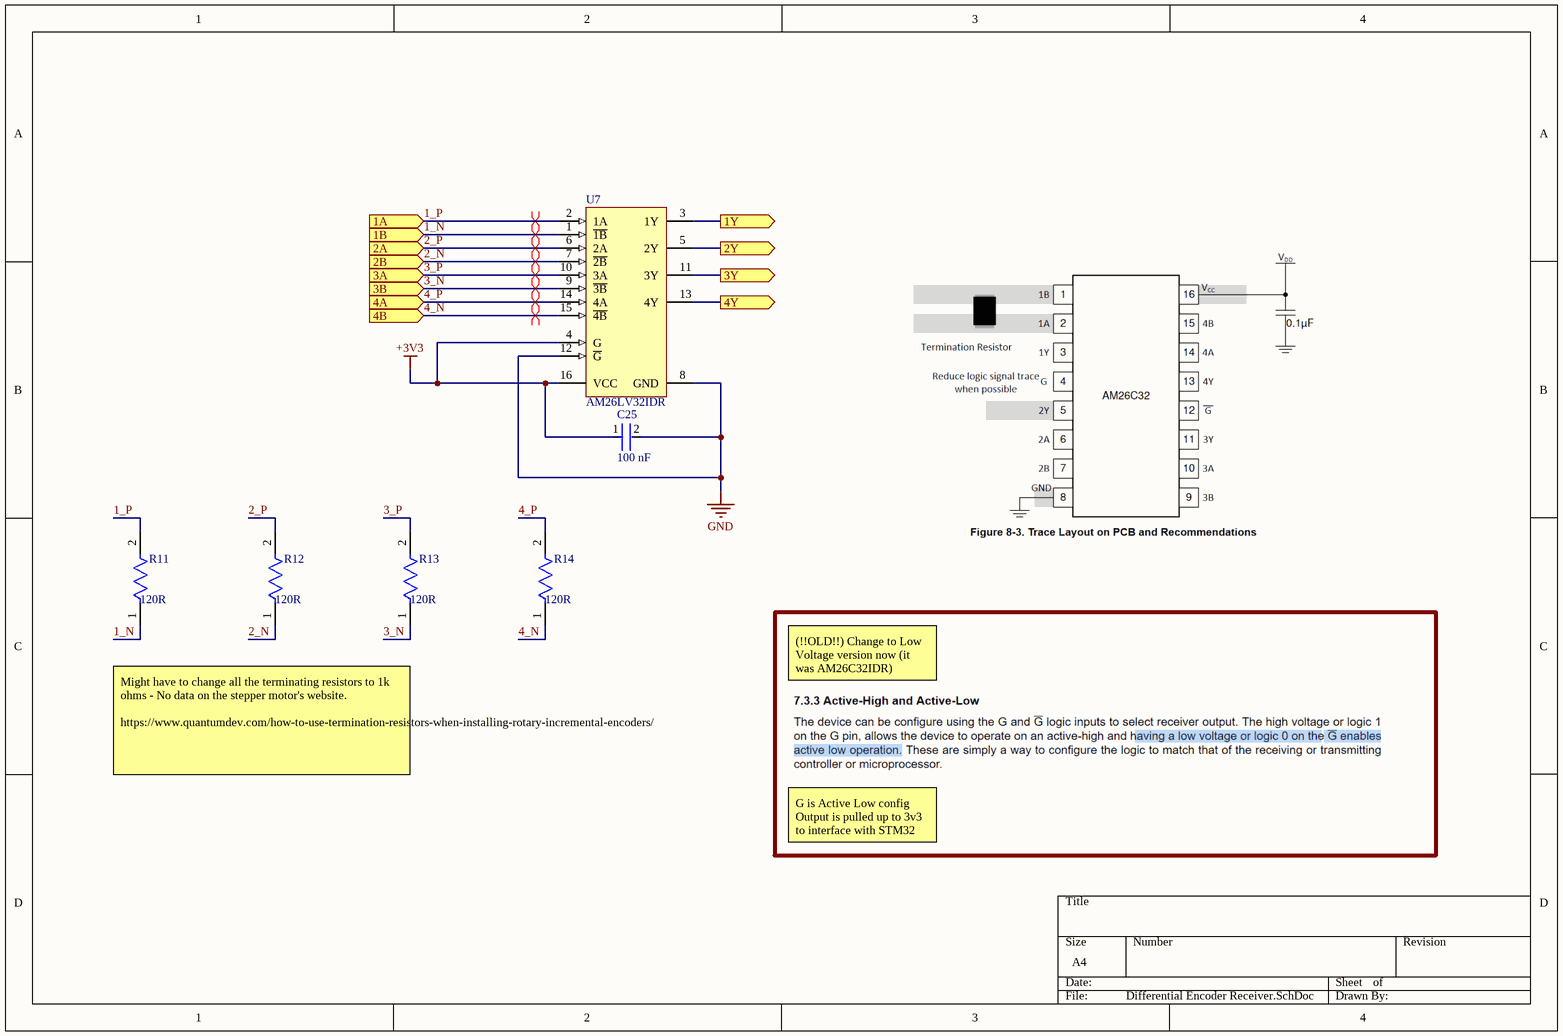
[diagram p2: Differential Encoder Receiver.SchDoc]

### Parts
C25  Capacitance: 100 nF  [FP-CC0603-DA-MFG]  (hidden comment: CC0603KRX7R9BB104)
R11  Resistance: 120R  [FP-CRCW0603-e3-MFG]  (hidden comment: 0603WAF1200T5E)
R12  Resistance: 120R  [FP-CRCW0603-e3-MFG]  (hidden comment: 0603WAF1200T5E)
R13  Resistance: 120R  [FP-CRCW0603-e3-MFG]  (hidden comment: 0603WAF1200T5E)
R14  Resistance: 120R  [FP-CRCW0603-e3-MFG]  (hidden comment: 0603WAF1200T5E)
U7  AM26LV32IDR  [D0016A_N]

### Ports
1A (in, see Actuation[2B]), 1B (in, see Actuation[2B]), 1Y (out, see Actuation[3B]), 2A (in, see Actuation[2B]), 2B (in, see Actuation[2B]), 2Y (out, see Actuation[3B]), 3A (in, see Actuation[2B]), 3B (in, see Actuation[2B]), 3Y (out, see Actuation[3B]), 4A (in, see Actuation[2B]), 4B (in, see Actuation[2B]), 4Y (out, see Actuation[3B])

### Nets
+3V3: C25.1 U7.4(G) U7.16(VCC)
GND: C25.2 U7.8(GND) U7.12(~{G})
1_N: R11.1 U7.1(~{1B}) ; port 1B
1_P: R11.2 U7.2(1A) ; port 1A
1Y: U7.3(1Y) ; port 1Y
2_N: R12.1 U7.7(~{2B}) ; port 2B
2_P: R12.2 U7.6(2A) ; port 2A
2Y: U7.5(2Y) ; port 2Y
3_N: R13.1 U7.9(~{3B}) ; port 3B
3_P: R13.2 U7.10(3A) ; port 3A
3Y: U7.11(3Y) ; port 3Y
4_N: R14.1 U7.15(~{4B}) ; port 4B
4_P: R14.2 U7.14(4A) ; port 4A
4Y: U7.13(4Y) ; port 4Y

### Channels
U_Differential Encoder Receiver 1: designators end in _U_Differential_Encoder_Receiver_1; ports 1A=1_P 1B=1_N 1Y=ENC1_A 2A=2_P 2B=2_N 2Y=ENC1_B 3A=3_P 3B=3_N 3Y=ENC1_Z 4A=4_P_U_Differential Encoder Receiver 1 4B=4_N_U_Differential Encoder Receiver 1 4Y=NetU7_U_Differential_Encoder_Receiver_1_13
U_Differential Encoder Receiver 2: designators end in _U_Differential_Encoder_Receiver_2; ports 1A=1_P 1B=1_N 1Y=ENC2_A 2A=2_P 2B=2_N 2Y=ENC2_B 3A=3_P 3B=3_N 3Y=ENC2_Z 4A=4_P_U_Differential Encoder Receiver 2 4B=4_N_U_Differential Encoder Receiver 2 4Y=NetU7_U_Differential_Encoder_Receiver_2_13
U_Differential Encoder Receiver 3: designators end in _U_Differential_Encoder_Receiver_3; ports 1A=1_P 1B=1_N 1Y=ENC3_A 2A=2_P 2B=2_N 2Y=ENC3_B 3A=3_P 3B=3_N 3Y=ENC3_Z 4A=4_P_U_Differential Encoder Receiver 3 4B=4_N_U_Differential Encoder Receiver 3 4Y=NetU7_U_Differential_Encoder_Receiver_3_13
U_Differential Encoder Receiver 4: designators end in _U_Differential_Encoder_Receiver_4; ports 1A=1_P 1B=1_N 1Y=ENC4_A 2A=2_P 2B=2_N 2Y=ENC4_B 3A=3_P 3B=3_N 3Y=ENC4_Z 4A=4_P_U_Differential Encoder Receiver 4 4B=4_N_U_Differential Encoder Receiver 4 4Y=NetU7_U_Differential_Encoder_Receiver_4_13

### Layout directives
differential pair: 1_N, 1_P, 2_N, 2_P, 3_N, 3_P, 4_N_U_Differential Encoder Receiver 1, 4_P_U_Differential Encoder Receiver 1

### Notes on the sheet
- (!!OLD!!) Change to Low Voltage version now (it was AM26C32IDR)
- Might have to change all the terminating resistors to 1k ohms - No data on the stepper motor's website.
  https://www.quantumdev.com/how-to-use-termination-resistors-when-installing-rotary-incremental-encoders/
- G is Active Low config
  Output is pulled up to 3v3 to interface with STM32

### Library data of the parts
C25 = CMP-2100-03601-2: as C4 on sheet Actuation; Height: 0.9mm; Voltage: 50 V; ComponentLink2Description: Datasheet; Device Class L2: Capacitors; Temperature Range High: +125°C; Category: Cap; Footprint Url: http://www.yageo.com/exep/pages/download/literatures/UPY-C_GEN_24.pdf; ComponentLink2URL: http://www.yageo.com/documents/recent/UPY-GPHC_X7R_6.3V-to-50V_18.pdf; Package: CC0603-DA; Temperature: -55°C to +125°C; Voltage Rating: 50 V; Temperature Characteristic: X7R; Device Class L1: Passive Components; Temperature Range Low: -55°C; Manufacturer Part Number: CC0603KRX7R9BB104; RoHS: TRUE; Automotive: No; Device Class L3: Ceramic Capacitors; Octopart: https://octopart.com/cc0603krx7r9bb104-yageo-42244635; Mouser Description: Multilayer Ceramic Capacitor, CC Series, 0.1 - F, - 10%, X7R, 50 V, 0603 [1608 Metric]; Lead Free: Yes; Digikey Description: CAP CER 0.1UF 50V X7R 0603
R11-R14 = CMP-1666-00020-3: 100mW Thick Film Resistors 75V ±100ppm/℃ ±1% 120Ω 0603 Chip Resistor - Surface Mount ROHS; Temperature Coefficient: 100ppm/°C; RoHS Compliant: Yes; Lead Free: Lead Free; Termination: SMD/SMT; Radiation Hardening: No; Case Code (Imperial): 0603; Series: CRCW; Resistance Tolerance: 1%; Number of Terminations: 2; Tolerance: 1%; Max Operating Temperature: 155°C; Power Rating: 100mW; Contact Plating: Tin; Package Quantity: 10; Max Power Dissipation: 100mW; Case Code (Metric): 1608; Weight: 7.1E-05oz; Packaging: Tape and Reel; Working Voltage: 75V; Mount: Surface Mount; Military Standard: Not; Construction: Rectangular; Features: Automotive AEC-Q200; Depth: 0.85mm; Min Operating Temperature: -55°C; Case/Package: 0603; Height: 0.45mm; Voltage Rating (DC): 75V; Width: 0.033inch; Technology: THICK FILM; Length: 1.55mm; Voltage Rating: 75V; Resistor Type: Thick Film
U7 = CMP-0310-00279-2: Low-Voltage High-Speed Quadruple Differential Line Receiver, 3.3V, -40 to 85 degC, 16-Pin SOIC (D), Green (RoHS & no Sb/Br); Manufacturer: Texas Instruments; Supply Voltage(s)(V): 3.3; ESD(kV): 2; Receivers Per Package: 4; ICC(Max)(mA): 17; Rating: Catalog; SubFamily: RS-422; Eco-Plan: Green (RoHS & no Sb/Br); PackageDescription: 16-Pin Plastic Small Outline Integrated Circuit, 9.9 x 3.9 mm, Pitch 1.27 mm Pitch; Code_JEDEC: MS-012AC; PackageVersion: revM, Jun-2011; ComponentLink2Description: Package Specification; ComponentLink2URL: http://www.ti.com/litv/pdf/mpds178g; PartNumber: AM26LV32IDR; PackageReference: D0016A; ComponentLink1URL: http://www.ti.com/general/docs/lit/getliterature.tsp?genericPartNumber=AM26LV32&fileType=pdf; DatasheetVersion: SLLS202E; ComponentLink1Description: Datasheet; Footprint: AM26LS32; Mounting Technology: Surface Mount

## Sheet Power.SchDoc
size A4; SheetNumber: 4; SheetTotal: 6
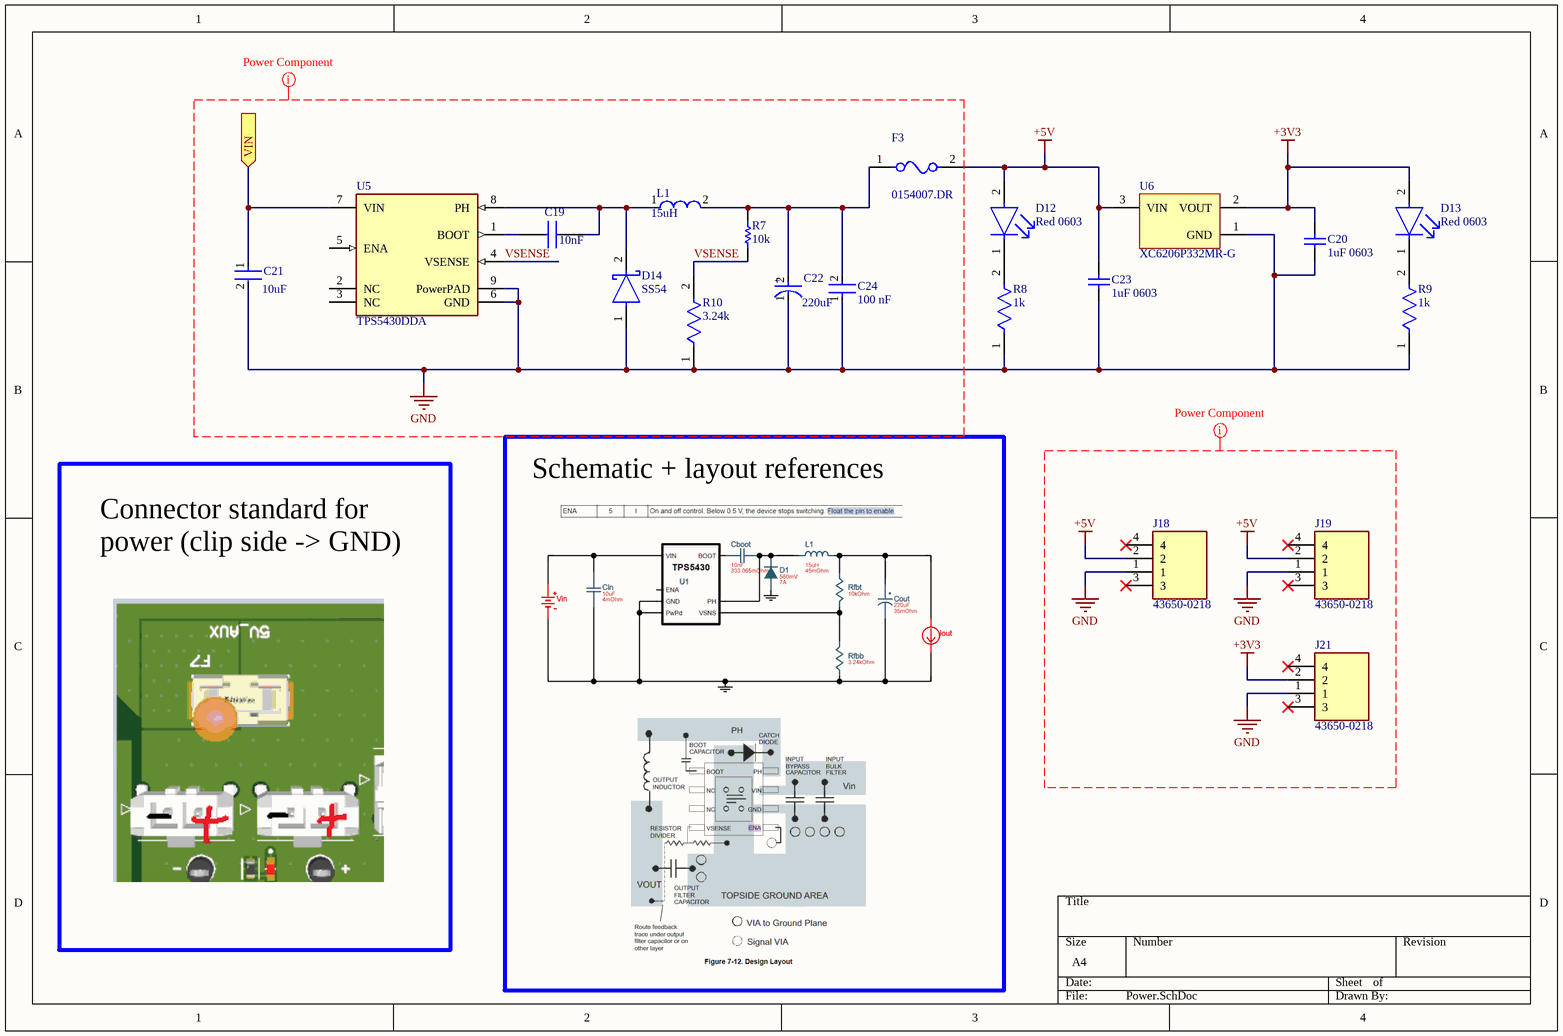
[diagram p3: Power.SchDoc]

### Parts
C19  Capacitance: 10nF  [CAPC1608X95N]  (hidden comment: 10nF 0603)
C20  1uF 0603  [CAPC1608X95N]
C21  Capacitance: 10uF  [FP-GRM21B-0_2-e0_2_0_7-IPC_A]  (hidden comment: GRM21BR61H106KE43L)
C22  Capacitance: 220uF  [FP-POSCAP-B2-MFG]  (hidden comment: 6TPE220MAZB)
C23  1uF 0603  [CAPC1608X95N]
C24  Capacitance: 100 nF  [FP-CC0603-DA-MFG]  (hidden comment: CC0603KRX7R9BB104)
D12  Red 0603  [FP-150060RS55040-MFG]
D13  Red 0603  [FP-150060RS55040-MFG]
D14  SS54  [FP-403AE-MFG]
F3  0154007.DR  [FP-0154-MFG]
J18  43650-0218  [43650-02YY_18192063]
J19  43650-0218  [43650-02YY_18192063]
J21  43650-0218  [43650-02YY_18192063]
L1  Inductance: 15uH  [FP-SPM10040-MFG]  (hidden comment: MWSA1004S-150MT)
R7  Resistance: 10k  [RESC1609X50X30NL8T20]  (hidden comment: 0603WAF1002T5E)
R8  1k  [FP-RC0603-0_55-IPC_C]
R9  1k  [FP-RC0603-0_55-IPC_C]
R10  Resistance: 3.24k  [FP-CRCW0603-e3-IPC_A]  (hidden comment: 0603WAF3241T5E)
U5  TPS5430DDA  [FP-DDA0008J-MFG]
U6  XC6206P332MR-G  [SOT-23-TT3_N]

### Ports
VIN (in, see Actuation[7A], Drivers[3A])

### Nets
+3V3: C20.2 D13.2(A) J21.2 U6.2(VOUT)
+5V: C23.2 D12.2(A) F3.2 J18.2 J19.2 U6.3(VIN)
GND: C20.1 C21.2 C22.1(C) C23.1 C24.1 D14.1(A) J18.1 J19.1 J21.1 R8.1 R9.1 R10.1 U5.6(GND) U5.9(PowerPAD) U6.1(GND)
STEPPER_VIN: C21.1 U5.7(VIN) ; port VIN
VSENSE: R7.1 R10.2 U5.4(VSENSE)
NetC19_1: C19.1 U5.1(BOOT)
NetC19_2: C19.2 D14.2(C) L1.1 U5.8(PH)
NetC22_2: C22.2(A) C24.2 F3.1 L1.2 R7.2
NetD12_1: D12.1(C) R8.2
NetD13_1: D13.1(C) R9.2

Not connected (* = marked no-connect by the designer): J18 3* 4*; J19 3* 4*; J21 3* 4*; U5 2(NC) 3(NC) 5(ENA)

### Layout directives
CompClassName: Power Component: +3V3, +5V, GND, VSENSE

### Notes on the sheet
- Schematic + layout references
- Connector standard for power (clip side -> GND)
- (in symbol CMP-05429-000001-2) +

### Library data of the parts
C19 = CMP-123-000015-1: 50V 10nF X7R ±10% 0603 Multilayer Ceramic Capacitors MLCC - SMD/SMT ROHS; Manufacturer_Part_Number: 0603B103K500NT; Manufacturer_Name: FH (Guangdong Fenghua Advanced Tech); Datasheet Link: https://wmsc.lcsc.com/wmsc/upload/file/pdf/v2/lcsc/2304140030_FH--Guangdong-Fenghua-Advanced-Tech-0603B103K500NT_C57112.pdf
C20 C23 = CMP-00099-1: 1uF 0603, Ceramic Capacitor, Multilayer, Ceramic, 50V, 10% +Tol, 10% -Tol, X5R, 15% TC, 1uF, Surface Mount, 0603; Multilayer: Yes; Capacitor Type: Ceramic; Height: 0.9mm; Package Shape: Rectangular; JESD-609 Code: e3; Value: 1uF; Terminal Finish: Nickel; Length: 1.6mm; Package Style: SMTMeter; RoHS Compliant: Yes; Mounting Technology: Surface Mount; Case/Package: 0603; Rated DC Voltage (URdc): 50V; Pins: 2; Min Operating Temperature: -55°C; Max Operating Temperature: 85°C; Dielectric Material: Ceramic; Width: 0.8mm; Termination: Wraparound; Packaging: Tape and Reel; Tolerance (fill in as +-): 10%; Tolerance  (fill in as +-): 10%; Reach SVHC Compliant: Yes; Temperature Characteristics Code: X5R
C21 = CMP-06035-004402-1: Chip Multilayer Ceramic Capacitors for General Purpose, 0805, 10uF, X5R, 15%, 10%, 50V; Voltage Rating (DC): 50V; Dielectric: X5R; Tolerance: 10%; Thickness: 1.25mm; Length: 2mm; Width: 1.25mm
C22 = CMP-05429-000001-2: Molded Tantalum Polymer Capacitor 220uF 20% 6.3V life 1000Hours SMD 1411; ESR (Equivalent Series Resistance): 35mR; Ripple Current: 1.4A; Leakage Current: 138.6uA; Polarity: Polar; Dissipation Factor: 10%; Construction: Flat; Case/Package: Molded; Min Operating Temperature: -55°C; Voltage Rating (DC): 6.3V; Voltage: 6.3V; Termination: SMD/SMT; Voltage Rating: 6.3V; Mount: Surface Mount; Features: General Purpose; Height - Seated (Max): 0.079inch; Case Code (Imperial): 1210; REACH SVHC: No SVHC; Packaging: Tape and Reel; Lead Free: Lead Free; Width: 2.8mm; Height: 1.9mm; Series: POSCAP™ TPE; Tolerance: 20%; Case Code (Metric): 3528; RoHS Compliant: Yes; Max Operating Temperature: 105°C; Number of Pins: 2; Radiation Hardening: No; Depth: 2.8mm; Package Quantity: 1; Length: 3.5mm
C24 = CMP-2100-03601-2: as C4 on sheet Actuation; Height: 0.9mm; Voltage: 50 V; ComponentLink2Description: Datasheet; Device Class L2: Capacitors; Temperature Range High: +125°C; Category: Cap; Footprint Url: http://www.yageo.com/exep/pages/download/literatures/UPY-C_GEN_24.pdf; ComponentLink2URL: http://www.yageo.com/documents/recent/UPY-GPHC_X7R_6.3V-to-50V_18.pdf; Package: CC0603-DA; Temperature: -55°C to +125°C; Voltage Rating: 50 V; Temperature Characteristic: X7R; Device Class L1: Passive Components; Temperature Range Low: -55°C; Manufacturer Part Number: CC0603KRX7R9BB104; RoHS: TRUE; Automotive: No; Device Class L3: Ceramic Capacitors; Octopart: https://octopart.com/cc0603krx7r9bb104-yageo-42244635; Mouser Description: Multilayer Ceramic Capacitor, CC Series, 0.1 - F, - 10%, X7R, 50 V, 0603 [1608 Metric]; Lead Free: Yes; Digikey Description: CAP CER 0.1UF 50V X7R 0603
D12 D13 = CMP-00010-2: Led Red Diffused 0603 SMD; Manufacturer Part No.: 150060RS55040; Lens Style: Flat; Luminous Intensity: 90mcd; Lens Size: 0.8mm; Dominant Wavelength: 624nm; Viewing Angle: 140°; Test Current: 20mA; Forward Voltage: 2V; Case Code (Metric): 1608; Lens Transparency: Diffused; Packaging: Cut Tape; Datasheet: https://www.farnell.com/datasheets/2621644.pdf?src-supplier=Farnell; Case/Package: 0603; Mounting Technology: Surface Mount; Height: 0.5mm; Length: 1.6mm; RoHS Compliant: Yes; Width: 0.8mm; Series: WL-SMDC; Case Code (Imperial): 0603; Color: Red
D14 = CMP-2000-04943-2: DIODE SCHOTTKY 40V 5A SMA; Standoff Height: 0.05mm; Manufacturer Part Number: SS54; Device Class L3: Schottky Diodes; Category: Diode; Automotive: No; Device Class L2: Diodes; Height: 2.5mm; Temperature Range High: +125°C; Device Class L1: Discrete Semiconductors; Package: 403AE; Temperature Range Low: -65°C; Temperature: -65°C to +125°C
F3 = CMP-08605-000035-1: FUSE BRD MNT 7A 125VAC/VDC 2SMD; Manufacturer: Littelfuse Inc; Max Fuse Ac Voltage: 125V; Fuse Blow Speed: Fast; Manufacturer Part Number: 0154007.DR; Device Class L1: Circuit Protection; Octopart: https://octopart.com/0154007.dr-littelfuse-565863; RoHS: TRUE; Automotive: No; Category: Fuse; Device Class L3: unset; Fuse Current: 7A; Device Class L2: Fuses; Height: 3.81mm; Temperature: -55°C to +125°C; ComponentLink2URL: https://www.littelfuse.com/~/media/electronics/datasheets/fuses/littelfuse_fuse_154_154t_154l_154tl_datasheet.pdf.pdf; Digikey Description: FUSE BRD MNT 7A 125VAC/VDC 2SMD; Package: 0154; Max Fuse Dc Voltage: 125V; Temperature Range High: +125°C; Lead Free: Yes; ComponentLink2Description: Datasheet; Mouser Description: Surface Mount Fuses Fuseblock w/ fuse 7A OMNI BLOK 154; Temperature Range Low: -55°C
J18 J19 J21 = 43650-0218: Connector; Manufacturer_Name: Molex; Datasheet Link: https://www.molex.com/pdm_docs/sd/436500218_sd.pdf; Height: 9.9mm; Manufacturer_Part_Number: 43650-0218; Mouser Part Number: 538-43650-0218; Mouser Price/Stock: https://www.mouser.co.uk/ProductDetail/Molex/43650-0218?qs=z57USrEQgt0ffE4b1Ju68Q%3D%3D
L1 = CMP-08253-000004-1: 6.5A 15uH ±20% 7A SMD,11x10mm Power Inductors ROHS; Category: Ind; Device Class L1: Passive Components; Device Class L2: Inductors; Device Class L3: Fixed Inductors; Height: 4mm; Manufacturer Part Number: MWSA1004S-150MT; Value: 15uH
R7 = CMP-1666-00005-4: as R18 on sheet Actuation; Max Operating Temperature: 155 degC; Voltage Rating: 75 V; PackageDescription: 2-Pin Surface Mount Device, Body 1.575 x 0.85 mm; ComponentLink1Description: Manufacturer URL; RoHSCompliant: true; PackageReference: 0603; REACH SVHC: Unknown; Length: 1.55 mm; Packaging: Tape and Reel; Min Operating Temperature: -55 degC; Mounting Technology: Surface Mount; ComponentLink2URL: https://datasheet.ciiva.com/11809/0900766b80d98afc-11809037.pdf; Height: 0.45 mm; ComponentLink2Description: Datasheet; Package Quantity: 5000; ComponentLink1URL: http://www.vishay.com/
R8 R9 = CMP-1659-00009-5: as R17 on sheet Actuation; Military Standard: Not; REACH SVHC: No SVHC; Size Code: 0603; Features: Moisture Resistant; Number of Terminations: 2; Technology: THICK FILM; Series: RC; Case Code (Metric): 1608; Resistance Tolerance: 1%; Resistor Type: Thick Film; Termination: SMD/SMT; Contact Plating: Tin; Radiation Hardening: No; Min Operating Temperature: -55°C; Max Operating Temperature: 155°C; Packaging: Tape and Reel; Max Power Dissipation: 100mW; RoHS Compliant: Yes; Height: 0.45mm; Lead Free: Lead Free; Case/Package: 0603; Length: 1.6mm; Tolerance: 1%; Case Code (Imperial): 0603; Construction: Rectangular; Depth: 0.8mm
R10 = CMP-2000-03299-2: 100mW Thick Film Resistors 75V ±100ppm/℃ ±1% 3.24kΩ 0603 Chip Resistor - Surface Mount ROHS; Temperature Coefficient: 100ppm/°C; Depth: 0.85mm; Case/Package: 0603; Number of Terminations: 2; Case Code (Imperial): 0603; Width: 0.85mm; Number of Pins: 2; Termination: SMD/SMT; Power Rating: 100mW; Length: 1.55mm; Case Code (Metric): 1608; Composition: Thick Film; Height: 0.45mm; Max Power Dissipation: 100mW; Mount: Surface Mount
U5 = CMP-2000-04960-2: IC REG BUCK ADJUSTABLE 3A 8SOPWR; Manufacturer: Texas Instruments; Max Junction Temp: +125°C; Max Supply Voltage: 36V; Switching Frequency: 500kHz; Output Type: AdjustableProgrammable; Standoff Height: 0mm; Output Voltage: 1.23-31V; Max Duty Cycle: 89%; Nominal Supply Current: 3mA; Min Supply Voltage: 5.5V; Number Of Outputs: 1; Temperature: -40°C to +125°C; Temperature Range High: +125°C; Manufacturer Part Number: TPS5430DDA; Device Class L3: Voltage Regulators - Switching; Mouser Description: Voltage Regulators - Switching Regulators 5.5 to 36V Input 3A Step Dwn Converter; Switching Topology: Buck; ComponentLink2URL: http://www.ti.com/lit/ds/symlink/tps5431.pdf; ComponentLink2Description: Datasheet; Device Class L2: Power Management ICs; Device Class L1: Integrated Circuits (ICs); Digikey Description: IC REG BUCK ADJUSTABLE 3A 8SOPWR; RoHS: TRUE; Octopart: https://octopart.com/tps5430dda-texas+instruments-589977; Output Current: 3A; Automotive: No; Lead Free: Yes; Category: IC; Package: DDA0008J; Temperature Range Low: -40°C; Height: 1.7mm
U6 = CMP-0136-00791-1: 200mA Fixed 3.3V Positive electrode 6V SOT-23-3L Linear Voltage Regulators (LDO) ROHS; Code_IPC: SOT23-3; PackageReference: SOT-23-TT3; PackageDescription: 3-Lead Plastic Small Outline Transistor (TT) [SOT-23]